# EAGLE design GM-UART-V1 (EAGLE 9.3.0)
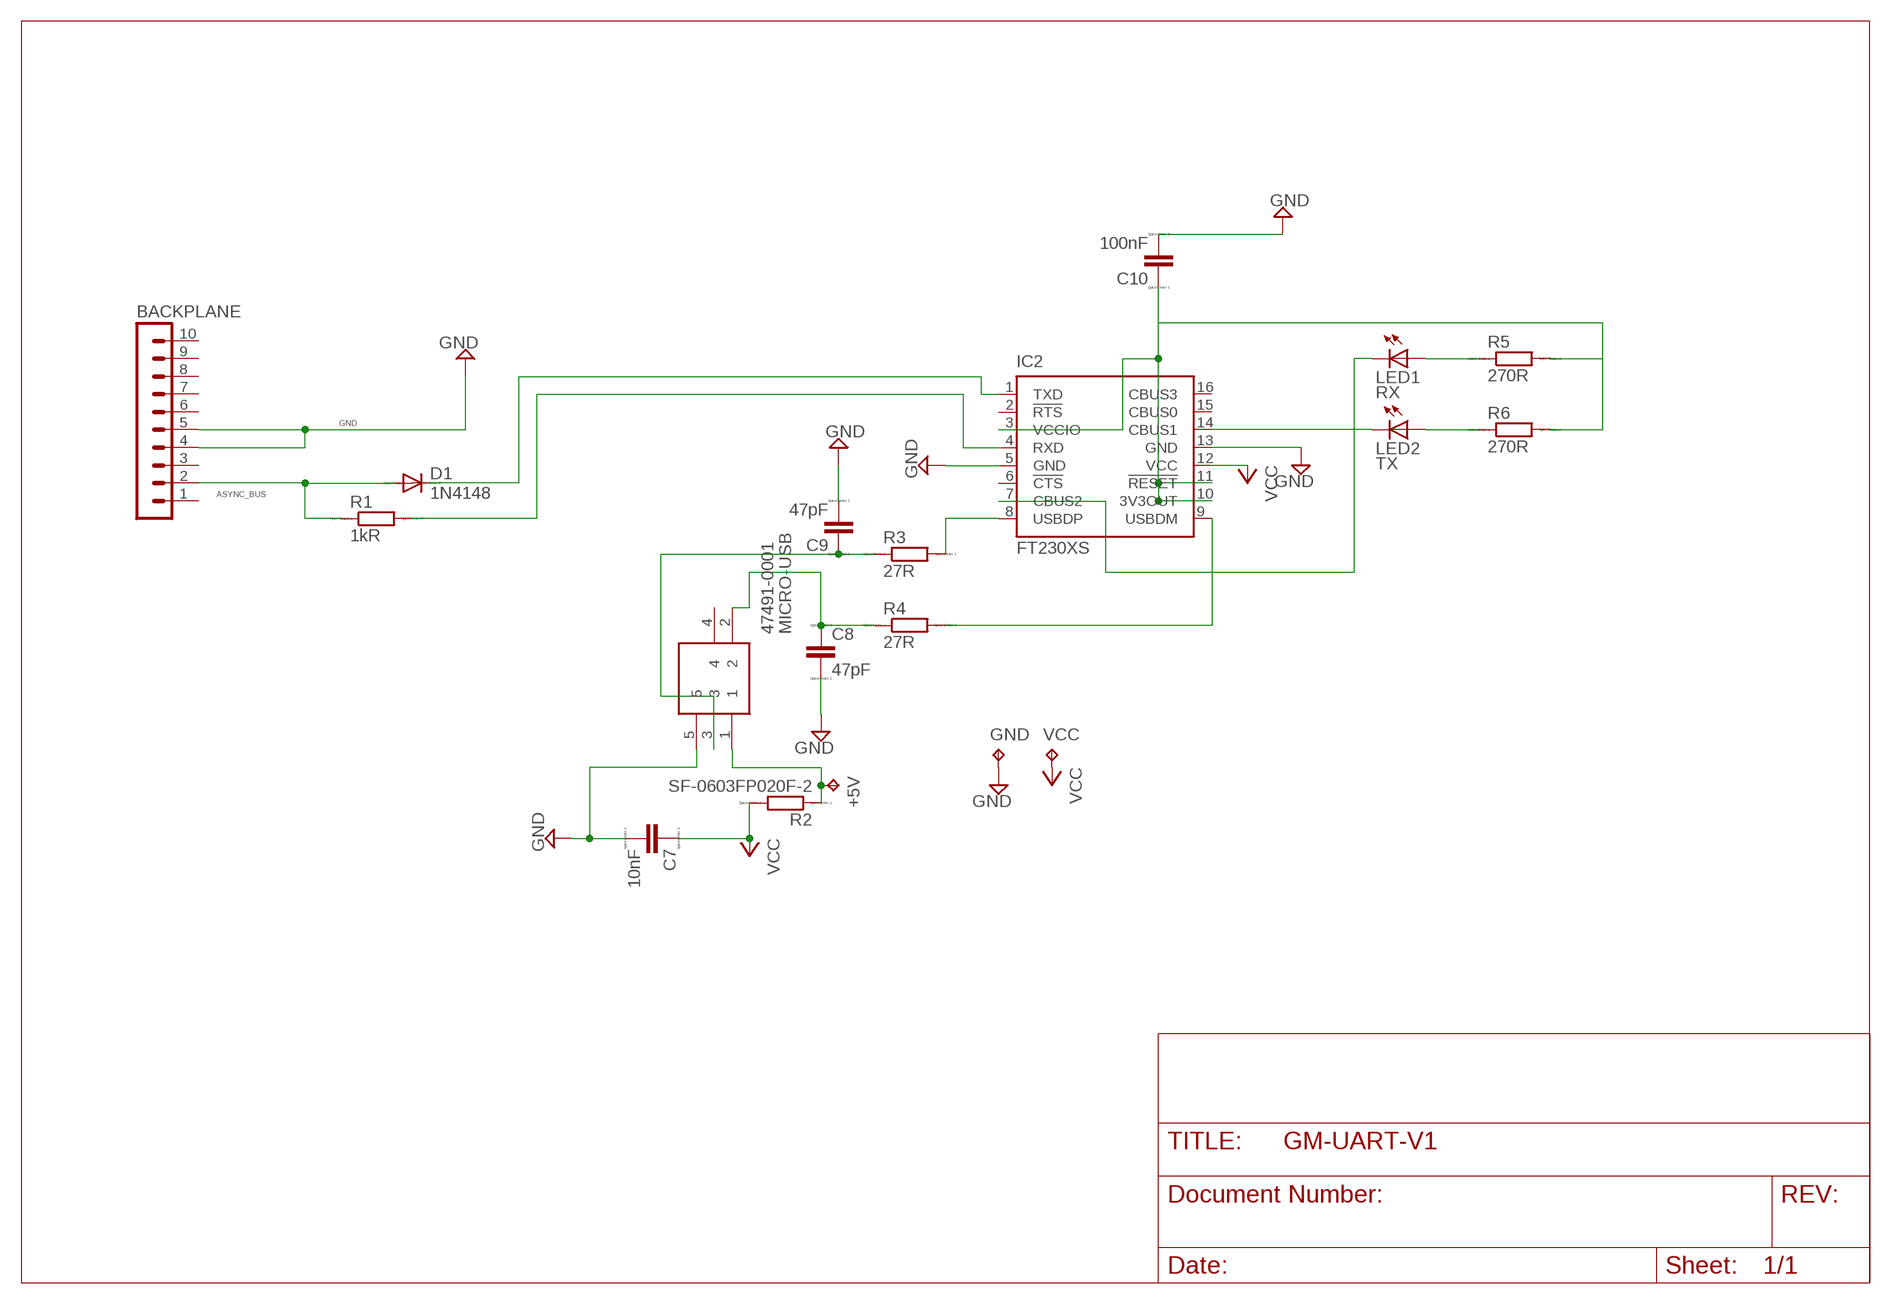
[diagram p0: schematic, sheet 1]

## Parts
+5V  VCC-Unfused  TPTP14SQ  [TP14SQ]
BACKPLANE  MA10-1  [MA10-1]
C7  10nF  CC0402  [C0402]
C8  47pF  CC0402  [C0402]
C9  47pF  CC0402  [C0402]
C10  100nF  CC0402  [C0402]
D1  1N4148  DIODE-SOD523  [SOD523]
GND  TPTP14SQ  [TP14SQ]
IC2  FT230XS  [SSOP16]
LED1  RX  TLLG4400  [LED3MM]
LED2  TX  TLLR4400  [LED3MM]
MICRO-USB  47491-0001  [47491-0001]
R1  1kR  RR0402  [R0402]
R2  SF-0603FP020F-2  RR0603  [R0603]
R3  27R  RR0402  [R0402]
R4  27R  RR0402  [R0402]
R5  270R  R0207/10  [0207/10]
R6  270R  R0207/10  [0207/10]
VCC  VCC-Fused  TPTP14SQ  [TP14SQ]

## Nets
ASYNC_BUS: BACKPLANE.2 D1.A R1.1
GND: BACKPLANE.4 BACKPLANE.5 C7.2 C8.2 C9.2 C10.2 GND.TP IC2.5(GND) IC2.13(GND) MICRO-USB.5
N$1: +5V.TP MICRO-USB.1 R2.1
N$2: LED1.A R5.1
N$3: LED2.A R6.1
N$4: C10.1 IC2.3(VCCIO) IC2.10(3V3OUT) IC2.11(!RESET) R5.2 R6.2
N$5: IC2.8(USBDP) R3.2
N$6: IC2.9(USBDM) R4.2
RX: IC2.4(RXD) R1.2
RX-LED: IC2.7(CBUS2) LED1.K(C)
TX: D1.C IC2.1(TXD)
TX-LED: IC2.14(CBUS1) LED2.K(C)
USBDM: C8.1 MICRO-USB.2 R4.1
USBDP: C9.1 MICRO-USB.3 R3.1
VCC: C7.1 IC2.12(VCC) R2.2 VCC.TP
Unconnected: BACKPLANE.1 BACKPLANE.3 BACKPLANE.6 BACKPLANE.7 BACKPLANE.8 BACKPLANE.9 BACKPLANE.10 IC2.2(!RTS) IC2.6(!CTS) IC2.15(CBUS0) IC2.16(CBUS3) MICRO-USB.4

## Library data of the parts
+5V GND VCC = testpad:TP: Test pad
BACKPLANE = con-lstb:MA10-1: PIN HEADER; OC_FARNELL: unknown; OC_NEWARK: unknown
C7-C10 = eagle-ltspice:C: CAPACITOR, European symbol; SPICEMODEL: NONE; SPICEPREFIX: C
D1 = diode:DIODE-: DIODE
IC2 = ftdichip:FT230X: USB to BASIC UART IC Auto generated by make-symbol-device-package-bsdl.ulp Rev. 43 Source: Data sheet <http://www.ftdichip.com/Support/Documents/DataSheets/ICs/DS_FT230X.pdf>
LED1 = led:TLLG4400: Low Current (2mA) LED 3 mm Tinted Diffused Package color GREEN Source: Data sheet <http://www.farnell.com/datasheets/391098.pdf>; MF: VISHAY SEMICONDUCTOR; OC_FARNELL: 1612435
LED2 = led:TLLR4400: Low Current (2mA) LED 3 mm Tinted Diffused Package color RED Source: Data sheet <http://www.farnell.com/datasheets/391100.pdf>; MF: VISHAY SEMICONDUCTOR; OC_FARNELL: 1612437
MICRO-USB = 47491-0001:47491-0001: Micro Mini USB Receptacle Mid Mount Assy Molex Right Angle SMT Type B Version 2.0 Micro USB Connector Socket, 30 V ac, 1A 47579 MICRO-USB Source: Datasheet <http://www.molex.com/pdm_docs/sd/474910001_sd.pdf>; ALLIED_NUMBER: 70374473; ALLIED_PRICE-STOCK: https://www.alliedelec.com/molex-incorporated-47491-0001/70374473/; DESCRIPTION: Micro Mini USB Receptacle Mid Mount Assy Molex Right Angle SMT Type B Version 2.0 Micro USB Connector Socket, 30 V ac, 1A 47579 MICRO-USB; HEIGHT: mm; MANUFACTURER_NAME: Molex; MANUFACTURER_PART_NUMBER: 47491-0001; MOUSER_PART_NUMBER: 538-47491-0001; MOUSER_PRICE-STOCK: https://www.mouser.com/Search/Refine.aspx?Keyword=538-47491-0001; RS_PART_NUMBER: 7025479P; RS_PRICE-STOCK: http://uk.rs-online.com/web/p/products/7025479P
R1-R6 = eagle-ltspice:R: RESISTOR, European symbol; SPICEMODEL: NONE; SPICEPREFIX: R

## Board
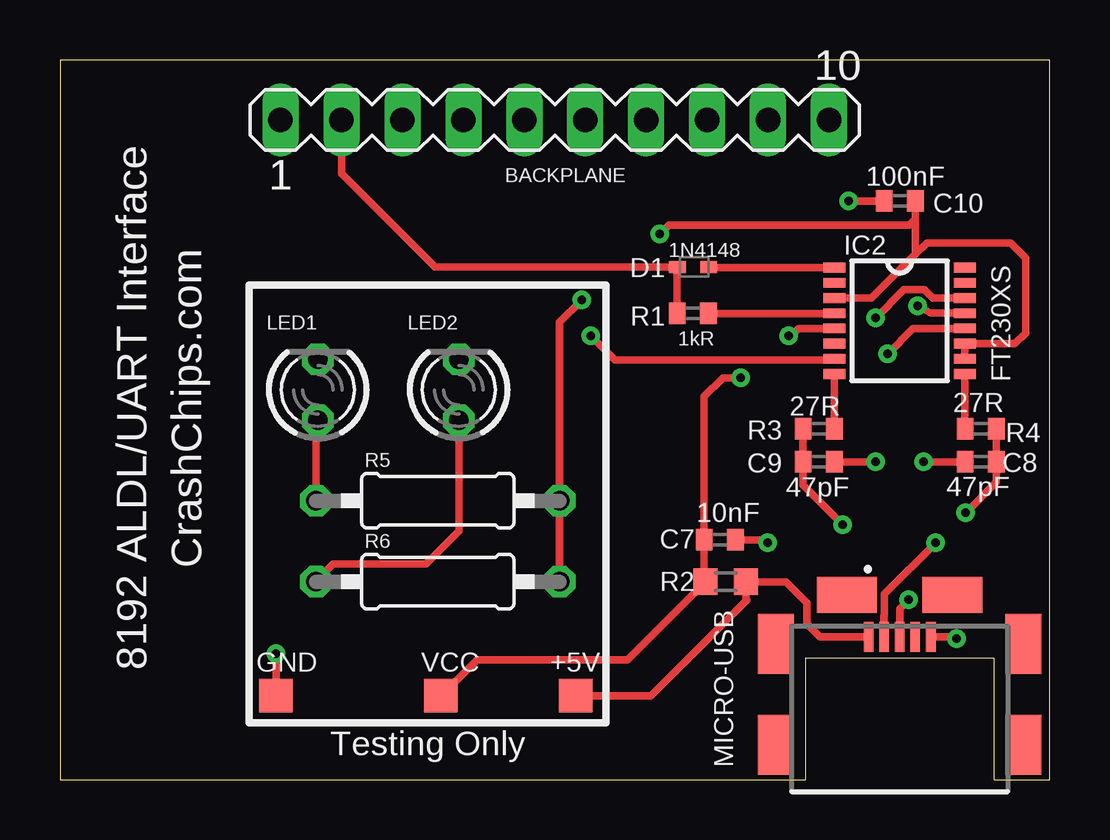
[diagram p1: board, top side]
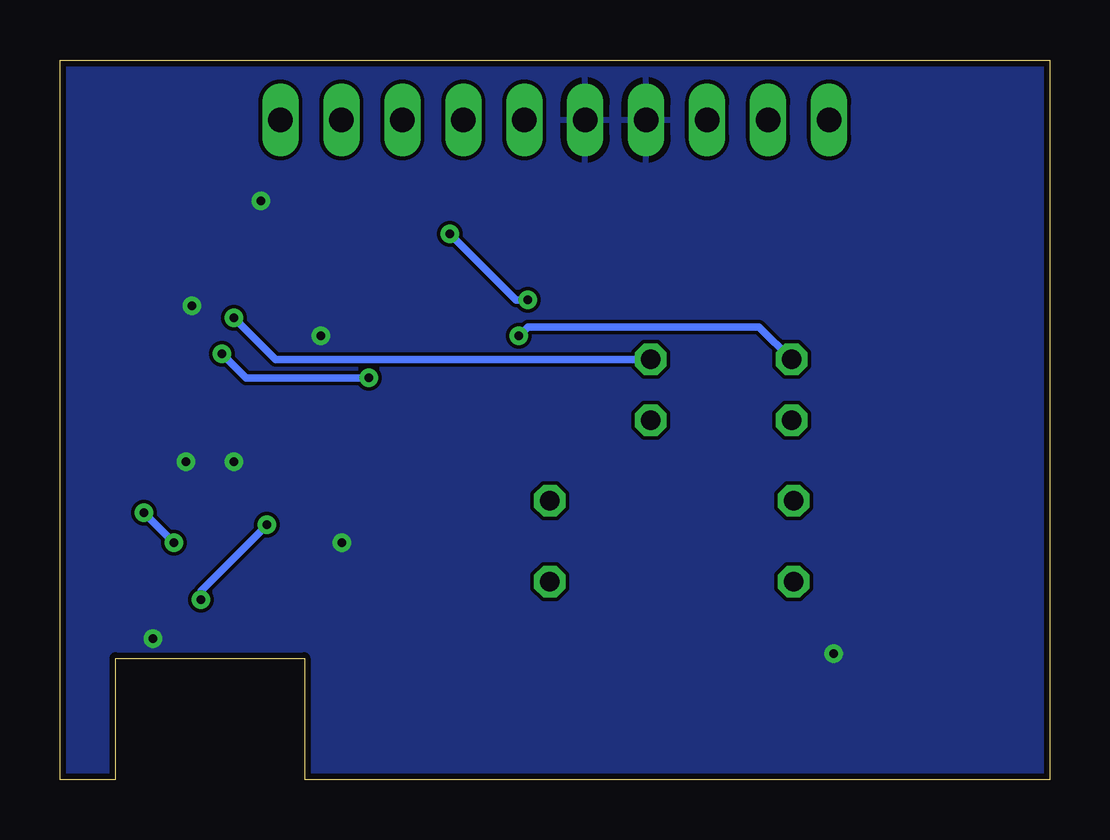
[diagram p2: board, bottom side, seen from below]

Size 41.25 x 30 mm. Coordinates in mm from the lower left corner, seen from the top.
Outline: 0,0 31.06,0 31.06,5.06 38.94,5.06 38.94,0 41.25,0 41.25,30 0,30 0,0
Copper layers (1*16): Top 0.035mm / dielectric 1.5mm / Bottom 0.035mm
Design rules "default *": minimum track width 6mil, minimum drill 0.35mm, track to track 6mil, track to pad 6mil, pad to pad 6mil, via to via 6mil, smd to smd 6mil, copper to edge 0.25mm, drill to drill 6mil, minimum pad ring 10mil, minimum via ring 8mil, stop-mask expansion 4mil, vias tented up to drill 0mil, thermal gap 10mil

### Footprints (pad centres in the part's own frame; a part is rotated, then mirrored left to right if it is on the bottom)
TP14SQ = smd 1.4 x 1.4: TP 0,0
MA10-1 = drill 1.016 long: 1 -11.43,0; 2 -8.89,0; 3 -6.35,0; 4 -3.81,0; 5 -1.27,0; 6 1.27,0; 7 3.81,0; 8 6.35,0; 9 8.89,0; 10 11.43,0
C0402 = smd 0.7 x 0.9: 1 -0.65,0; 2 0.65,0
SOD523 = smd 0.7 x 0.5: A 0.7,0; C -0.6,0
SSOP16 = smd 0.914 x 0.406: 1 -2.718,2.223; 2 -2.718,1.587; 3 -2.718,0.953; 4 -2.718,0.318; 5 -2.718,-0.318; 6 -2.718,-0.953; 7 -2.718,-1.587; 8 -2.718,-2.223; 9 2.718,-2.223; 10 2.718,-1.587; 11 2.718,-0.953; 12 2.718,-0.318; 13 2.718,0.318; 14 2.718,0.953; 15 2.718,1.587; 16 2.718,2.223
LED3MM = drill 0.813 octagon: A -1.27,0; K 1.27,0
47491-0001 = smd 1.25 x 0.4: 1 6.45,1.3; 2 6.45,0.65; 3 6.45,0; 4 6.45,-0.65; 5 6.45,-1.3 | smd 2.5 x 1.5: 6 6.15,5.15; 7 6.15,-5.15; 10 1.95,5.15; 11 1.95,-5.15 | smd 1.5 x 2.5: 8 8.2,2.2; 9 8.2,-2.2
R0402 = smd 0.7 x 0.9: 1 -0.65,0; 2 0.65,0
R0603 = smd 1 x 1.1: 1 -0.85,0; 2 0.85,0
0207/10 = drill 0.813 octagon: 1 -5.08,0; 2 5.08,0

### Placement (x,y rotation side)
+5V  21.5,3.5 0 top
BACKPLANE  20.62,27.5 0 top
C7  27.5,10 0 top
C8  38.38,13.25 180 top
C9  31.62,13.25 0 top
C10  35,24.12 180 top
D1  26.44,21.38 180 top
GND  9,3.5 0 top
IC2  35,19.12 0 top
LED1  10.75,16.25 90 top
LED2  16.62,16.25 90 top
MICRO-USB  35,-0.5 90 top
R1  26.38,19.44 0 top
R2  27.75,8.25 180 top
R3  31.62,14.62 0 top
R4  38.38,14.62 180 top
R5  15.75,11.62 0 top
R6  15.75,8.25 0 top
VCC  15.88,3.5 0 top

### Tracks (layer width: path | path; a pad name or v marks a point on that pad's centre or on a via)
ASYNC_BUS
  Top 0.305: 25.73,21.36 D1.A | R1.1 25.73,21.36 | BACKPLANE.2 11.73,25.27 15.64,21.36 25.73,21.36
GND  (via drill 0.35)
  Top 0.305: C9.2 v34,13.25 | IC2.13 36.31,19.44 v35.75,19.75 | IC2.5 30.81,18.81 v30.38,18.5 | C10.2 v32.88,24.12 | C7.2 29.38,10 v29.5,9.88 | MICRO-USB.5 37.3,5.95 v37.38,5.88 | C8.2 v36,13.25 | GND.TP v9,5.25
  pour Bottom: 0,30 41.25,30 41.25,0 0,0
N$1
  Top 0.305: MICRO-USB.1 31.68,5.95 31.12,6.5 31.12,7.38 30.25,8.25 R2.1 28.6,7.53 28.62,7.5 24.62,3.5 +5V.TP
N$2
  Top 0.305: R5.1 10.67,14.9 LED1.A
N$3
  Top 0.305: R6.1 10.67,8.29 11.38,9 15.25,9 16.62,10.38 LED2.A
N$4  (via drill 0.35)
  Top 0.305: IC2.10 IC2.11 39.8,18.17 40.25,18.62 40.25,21.75 39.62,22.38 36.12,22.38 35.65,21.9 | IC2.3 33.83,20.08 35.65,21.9 | 35.65,21.9 35.65,23.38 | 35.65,23.38 C10.1 | R6.2 R5.2 20.83,19.08 v21.75,20 | 35.65,23.38 35.4,23.12 25.38,23.12 v25,22.75
  Bottom 0.305: v25,22.75 22.25,20 v21.75,20
N$5
  Top 0.305: R3.2 IC2.8
N$6
  Top 0.305: R4.2 IC2.9
RX
  Top 0.305: R1.2 IC2.4
RX-LED  (via drill 0.35)
  Top 0.305: v22.12,18.5 23.12,17.5 32.25,17.5 IC2.7
  Bottom 0.305: LED1.K 12.11,18.88 21.75,18.88 v22.12,18.5
TX
  Top 0.305: D1.C 27.07,21.35 IC2.1
TX-LED  (via drill 0.35)
  Top 0.305: IC2.14 36.39,20.08 36.03,20.43 35.18,20.43 v34,19.25
  Bottom 0.305: LED2.K 32.27,17.52 v34,19.25
USBDM  (via drill 0.35)
  Top 0.305: R4.1 C8.1 39.02,12.4 v37.75,11.12 | MICRO-USB.2 34.35,6.82 34.36,6.82 34.36,7.73 v36.5,9.88
  Bottom 0.305: v37.75,11.12 v36.5,9.88
USBDP  (via drill 0.35)
  Top 0.305: R3.1 C9.1 30.98,12.28 v32.62,10.62 | MICRO-USB.3 35,7.12 v35.38,7.5
  Bottom 0.305: v35.38,7.5 35.38,7.88 v32.62,10.62
VCC  (via drill 0.35)
  Top 0.305: v28.38,16.75 27.62,16.75 26.85,15.97 C7.1 26.85,8.3 R2.2 23.65,5 17.38,5 VCC.TP | v34.5,17.75 35.56,18.81 IC2.12
  Bottom 0.305: v28.38,16.75 33.5,16.75 v34.5,17.75

### Text on the board
tNames: 8192 ALDL/UART Interface / CrashChips.com | Testing Only